# Altium schematic sheet Power.SchDoc
size A4; SheetNumber: 8
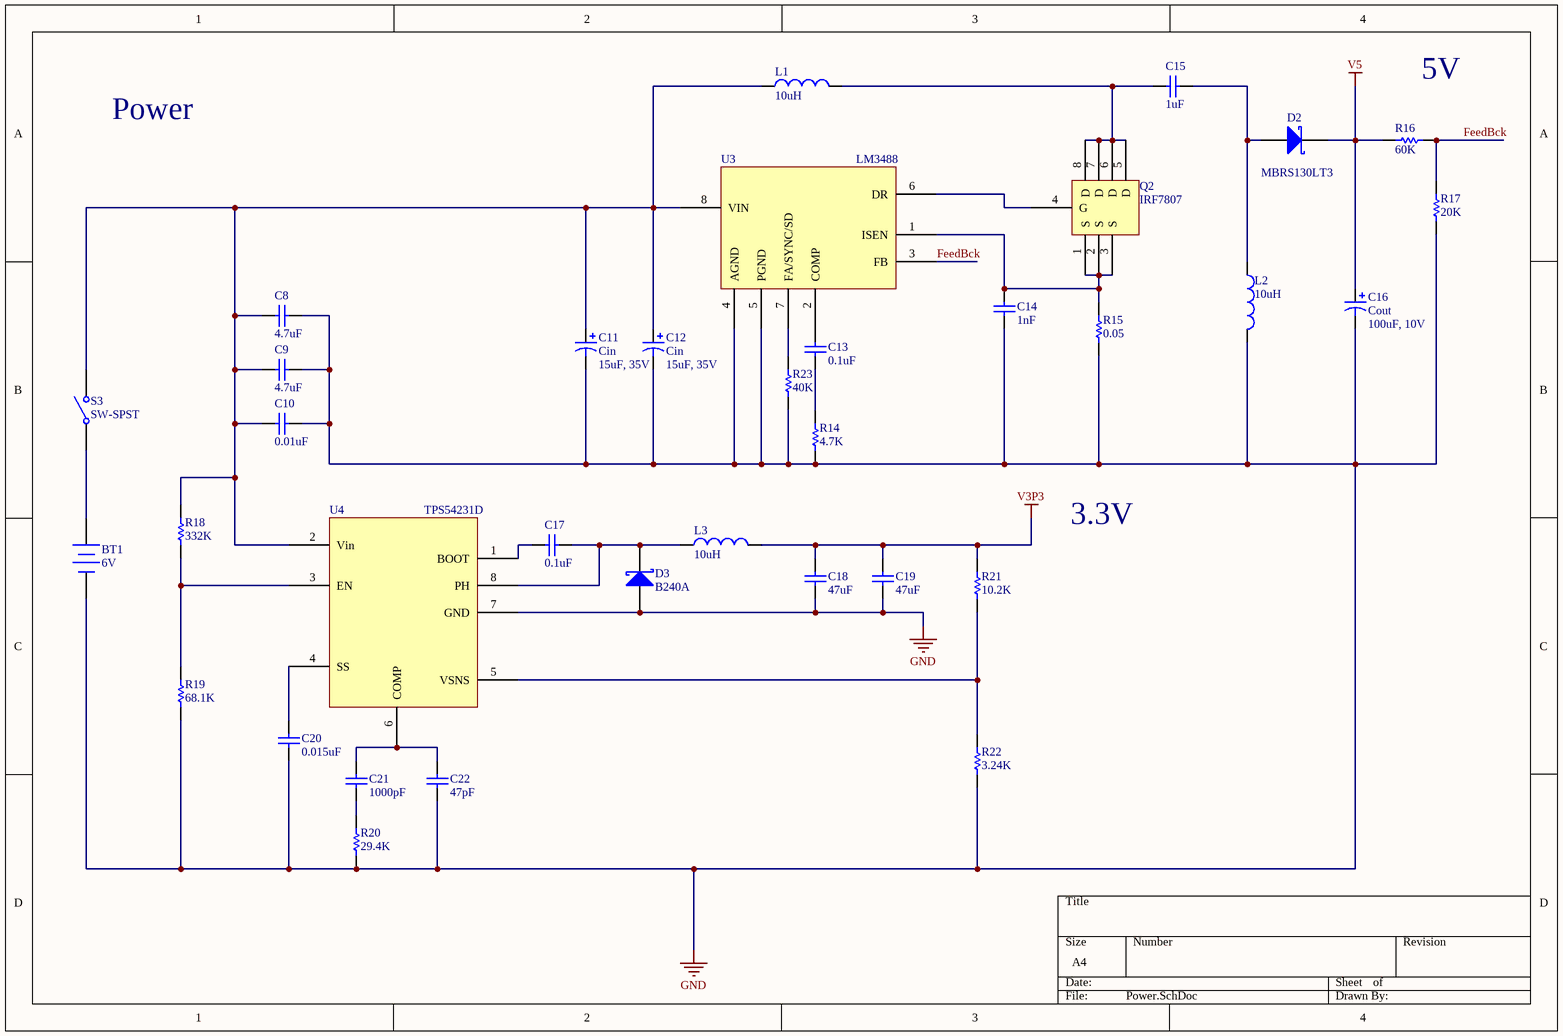
[diagram p0: Power.SchDoc]

## Parts
BT1  6V  [BAT-2]
C8  4.7uF  [own_0603]
C9  4.7uF  [own_0603]
C10  0.01uF  [own_0603]
C11  Cin  value 15uF, 35V  [WE-865080542005]
C12  Cin  value 15uF, 35V  [WE-865080542005]
C13  0.1uF  [own_0603]
C14  1nF  [own_0603]
C15  1uF  [own_0603]
C16  Cout  value 100uF, 10V  [SMT-HA-V-D]
C17  0.1uF  [own_0603]
C18  47uF  [own_0603]
C19  47uF  [own_0603]
C20  0.015uF  [own_0603]
C21  1000pF  [own_0603]
C22  47pF  [own_0603]
D2  MBRS130LT3  [SMB-403A-03-J]
D3  B240A  [SMA-B2XX/A]
L1  10uH  [RLB Series]
L2  10uH  [RLB Series]
L3  10uH  [RLB Series]
Q2  IRF7807  [SO-8]
R14  4.7K  [own_0603]
R15  0.05  [own_0603]
R16  60K  [own_0603]
R17  20K  [own_0603]
R18  332K  [own_0603]
R19  68.1K  [own_0603]
R20  29.4K  [own_0603]
R21  10.2K  [own_0603]
R22  3.24K  [own_0603]
R23  40K  [own_0603]
S3  SW-SPST  [SPST-2]
U3  LM3488  [S-PDSO-G8]
U4  TPS54231D  [R-PDSO-G8]

## Nets
GND: BT1.2(-) C8.2 C9.2 C10.2 C11.2 C12.2 C14.1 C16.2 C18.1 C19.1 C20.1 C22.1 D3.2(A) L2.2 R14.1 R15.1 R17.2 R19.2 R20.2 R22.2 R23.2 U3.4(AGND) U3.5(PGND) U4.7(GND)
V3P3: C18.2 C19.2 L3.2 R21.1
V5: C16.1 D2.1(K) R16.2
FeedBck: R16.1 R17.1 U3.3(FB)
NetBT1_1: BT1.1(+) S3.1(COMMON)
NetC8_1: C8.1 C9.1 C10.1 C11.1 C12.1 L1.1 R18.1 S3.2(NO) U3.8(VIN) U4.2(Vin)
NetC13_1: C13.1 R14.2
NetC13_2: C13.2 U3.2(COMP)
NetC14_2: C14.2 Q2.1(S) Q2.2(S) Q2.3(S) R15.2 U3.1(ISEN)
NetC15_1: C15.1 D2.2(A) L2.1
NetC15_2: C15.2 L1.2 Q2.5(D) Q2.6(D) Q2.7(D) Q2.8(D)
NetC17_1: C17.1 D3.1(K) L3.1 U4.8(PH)
NetC17_2: C17.2 U4.1(BOOT)
NetC20_2: C20.2 U4.4(SS)
NetC21_1: C21.1 R20.1
NetC21_2: C21.2 C22.2 U4.6(COMP)
NetQ2_4: Q2.4(G) U3.6(DR)
NetR18_2: R18.2 R19.1 U4.3(EN)
NetR21_2: R21.2 R22.1 U4.5(VSNS)
NetR23_1: R23.1 U3.7(FA/SYNC/SD)

## Notes on the sheet
- (near R16) 5V
- Power
- 3.3V

## Library data of the parts
BT1 = Battery: 4xAA
C8-C10 C13-C15 C17-C22 = Cap: Capacitor
  C8 C9: Value: 4.7uF
  C10: Value: 0.01uF
  C13 C17: Value: 0.1uF
  C14: Value: 1nF
  C15: Value: 1uF
  C18 C19: Value: 47uF
  C20: Value: 0.015uF
  C21: Value: 1000pF
  C22: Value: 47pF
C11 C12 = Cap Pol1: Polarized Capacitor (Radial); Fabricant: WURTH ELEKTRONIK; Fournisseur: Farnell; RefFabricant: 865080542005; RefFournisseur: 2466314
C16 = Cap Pol1: Polarized Capacitor (Radial); Fabricant: PANASONIC ELECTRONIC COMPONENTS; Fournisseur: Farnell; RefFabricant: EEEHA1A101WP; RefFournisseur: 1973294
D2 = Diode 10TQ035: Schottky Rectifier; Fabricant: ON SEMICONDUCTOR; Fournisseur: Farnell; RefFabricant: MBRS130LT3G; RefFournisseur: 9556931
D3 = Diode 10TQ035: Schottky Rectifier; Fabricant: DIODES INC.; Fournisseur: Farnell; RefFabricant: B240A-13-F; RefFournisseur: 1843669
L1-L3 = Inductor: Fabricant: BOURNS; RefFabricant: RLB0712-100KL; Fournisseur: Farnell; RefFournisseur: 2434811; Value: 10uH
Q2 = IRF7807: MOSFET-8; Fabricant: INFINEON; RefFabricant: IRF7807VTRPBF; Fournisseur: Farnell; RefFournisseur: 2839485
R14-R23 = Res1: Resistor
  R14: Value: 4.7K
  R15: Value: 0.05
  R16: Value: 60K
  R17: Value: 20K
  R18: Value: 332K
  R19: Value: 68.1K
  R20: Value: 29.4K
  R21: Value: 10.2K
  R22: Value: 3.24K
  R23: Value: 40K
S3 = SW-SPST: Single-Pole, Single-Throw Switch; RefFabricant: H8600VBAAA; Fabricant: Arcolectric; Fournisseur: Farnell; RefFournisseur: 151133
U3 = LM3488: SEPIC 5V; Fabricant: Texas Instruments; RefFabricant: LM3488MMX/NOPB; Fournisseur: Farnell; RefFournisseur: 2769264
U4 = TPS54231D: Buck SD 3.3V; Fabricant: Texas Instruments; Fournisseur: Farnell; RefFournisseur: 1755637; RefFabricant: TPS54231D